# EAGLE design sloth_final (EAGLE 7.6.0)
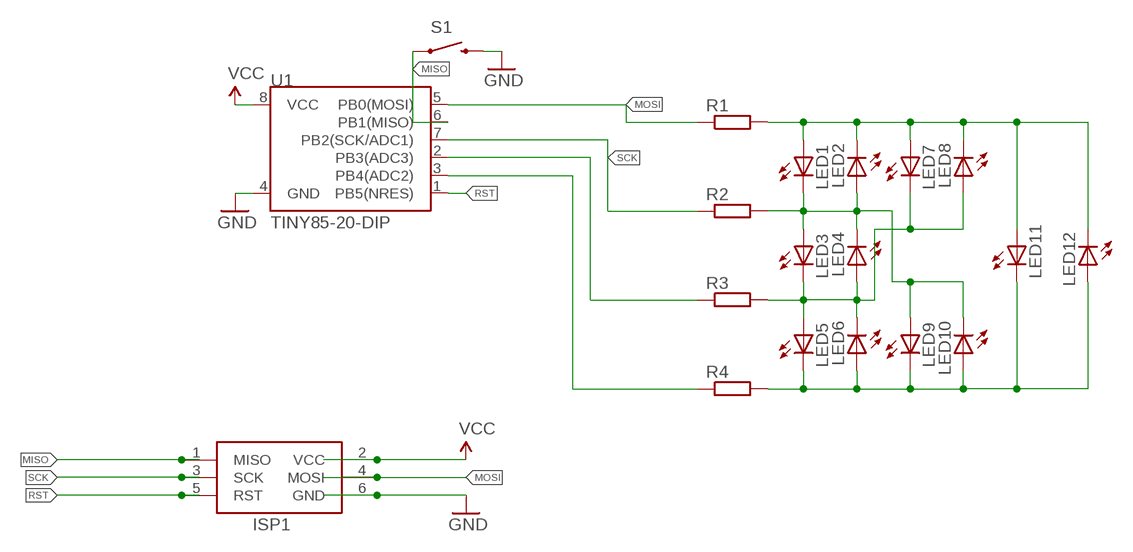
[diagram p0: schematic, sheet 1]

## Parts
ISP1  AVRISP-BOX  [AVRISP-BOX]
LED1  LEDCHIP-LED0805  [CHIP-LED0805]
LED2  LEDCHIP-LED0805  [CHIP-LED0805]
LED3  LEDCHIP-LED0805  [CHIP-LED0805]
LED4  LEDCHIP-LED0805  [CHIP-LED0805]
LED5  LEDCHIP-LED0805  [CHIP-LED0805]
LED6  LEDCHIP-LED0805  [CHIP-LED0805]
LED7  LEDCHIP-LED0805  [CHIP-LED0805]
LED8  LEDCHIP-LED0805  [CHIP-LED0805]
LED9  LEDCHIP-LED0805  [CHIP-LED0805]
LED10  LEDCHIP-LED0805  [CHIP-LED0805]
LED11  LEDCHIP-LED0805  [CHIP-LED0805]
LED12  LEDCHIP-LED0805  [CHIP-LED0805]
R1  R-EU_R0805  [R0805]
R2  R-EU_R0805  [R0805]
R3  R-EU_R0805  [R0805]
R4  R-EU_R0805  [R0805]
S1  SWITCH-MOMENTARY-2PTH  [TACTILE-PTH]
U1  TINY85-20-DIP  ATTINY45TINY85-20-DIP  [DIP08]

## Nets
GND: ISP1.6(GND) S1.3 U1.4(GND)
MISO: ISP1.1(MISO) S1.1 U1.6(PB1(MISO))
MOSI: ISP1.4(MOSI) R1.1 U1.5(PB0(MOSI))
N$1: R4.1 U1.3(PB4(ADC2))
N$2: LED5.C LED6.A LED9.C LED10.A LED11.C LED12.A R4.2
N$9: LED1.A LED2.C LED7.A LED8.C LED11.A LED12.C R1.2
N$11: LED1.C LED2.A LED3.A LED4.C LED9.A LED10.C R2.2
N$12: LED3.C LED4.A LED5.A LED6.C LED7.C LED8.A R3.2
PB3: R3.1 U1.2(PB3(ADC3))
RST: ISP1.5(RST) U1.1(PB5(NRES))
SCK: ISP1.3(SCK) R2.1 U1.7(PB2(SCK/ADC1))
VCC: ISP1.2(VCC) U1.8(VCC)

## Library data of the parts
ISP1 = adafruit:AVRISP: AVR ISP HEADER Standard 6 pin header for AVR programming
LED1-LED12 = led:LED: LED OSRAM: - CHIPLED LG R971, LG N971, LY N971, LG Q971, LY Q971, LO R971, LY R971 LH N974, LH R974 LS Q976, LO Q976, LY Q976 LO Q996 - Hyper CHIPLED LW Q18S LB Q993, LB Q99A, LB R99A - SideLED LS A670, LO A670, LY A670, LG A670, LP A670 LB A673, LV A673, LT A673, LW A673 LH A674 LY A675 LS A676, LA A676, LO A676, LY A676, LW A676 LS A679, LY A679, LG A679 - Hyper Micro SIDELED® LS Y876, LA Y876, LO Y876, LY Y876 LT Y87S - SmartLED LW L88C, LW L88S LB L89C, LB L89S, LG L890 LS L89K, LO L89K, LY L89K LS L896, LA L896, LO L896, LY L896 - TOPLED LS T670, LO T670, LY T670, LG T670, LP T670 LSG T670, LSP T670, LSY T670, LOP T670, LYG T670 LG T671, LOG T671, LSG T671 LB T673, LV T673, LT T673, LW T673 LH T674 LS T676, LA T676, LO T676, LY T676, LB T676, LH T676, LSB T676, LW T676 LB T67C, LV T67C, LT T67C, LS T67K, LO T67K, LY T67K, LW E67C LS E67B, LA E67B, LO E67B, LY E67B, LB E67C, LV E67C, LT E67C LW T67C LS T679, LY T679, LG T679 LS T770, LO T770, LY T770, LG T770, LP T770 LB T773, LV T773, LT T773, LW T773 LH T774 LS E675, LA E675, LY E675, LS T675 LS T776, LA T776, LO T776, LY T776, LB T776 LHGB T686 LT T68C, LB T68C - Hyper Mini TOPLED® LB M676 - Mini TOPLED Santana® LG M470 LS M47K, LO M47K, LY M47K Source: http://www.osram.convergy.de LUXEON: - LUMILED® LXK2-PW12-R00, LXK2-PW12-S00, LXK2-PW14-U00, LXK2-PW14-V00 LXK2-PM12-R00, LXK2-PM12-S00, LXK2-PM14-U00 LXK2-PE12-Q00, LXK2-PE12-R00, LXK2-PE12-S00, LXK2-PE14-T00, LXK2-PE14-U00 LXK2-PB12-K00, LXK2-PB12-L00, LXK2-PB12-M00, LXK2-PB14-N00, LXK2-PB14-P00, LXK2-PB14-Q00 LXK2-PR12-L00, LXK2-PR12-M00, LXK2-PR14-Q00, LXK2-PR14-R00 LXK2-PD12-Q00, LXK2-PD12-R00, LXK2-PD12-S00 LXK2-PH12-R00, LXK2-PH12-S00 LXK2-PL12-P00, LXK2-PL12-Q00, LXK2-PL12-R00 Source: www.luxeon.com KINGBRIGHT: KA-3528ASYC Source: www.kingbright.com
R1-R4 = rcl:R-EU_: RESISTOR, European symbol
S1 = SparkFun-Electromechanical:SWITCH-MOMENTARY-2: Various NO switches- pushbuttons, reed, etc
U1 = SparkFun-DigitalIC:ATTINY45: Atmel 8-pin 2/4/8kB flash uC; PROD_ID: IC-09445

## Board
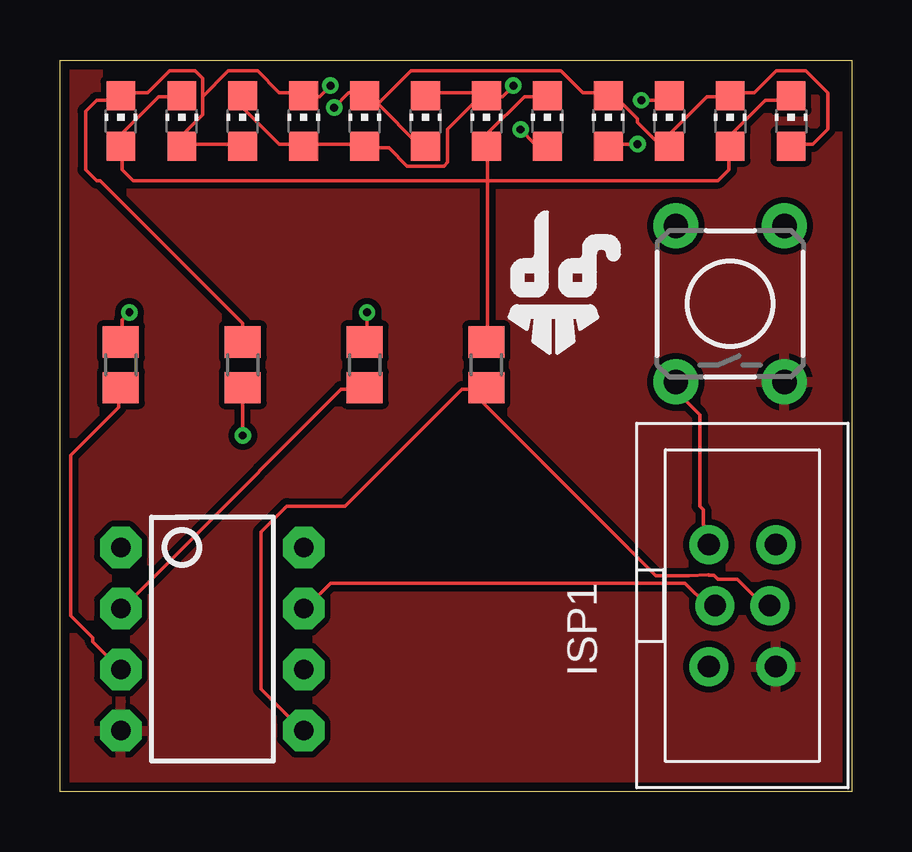
[diagram p1: board, top side]
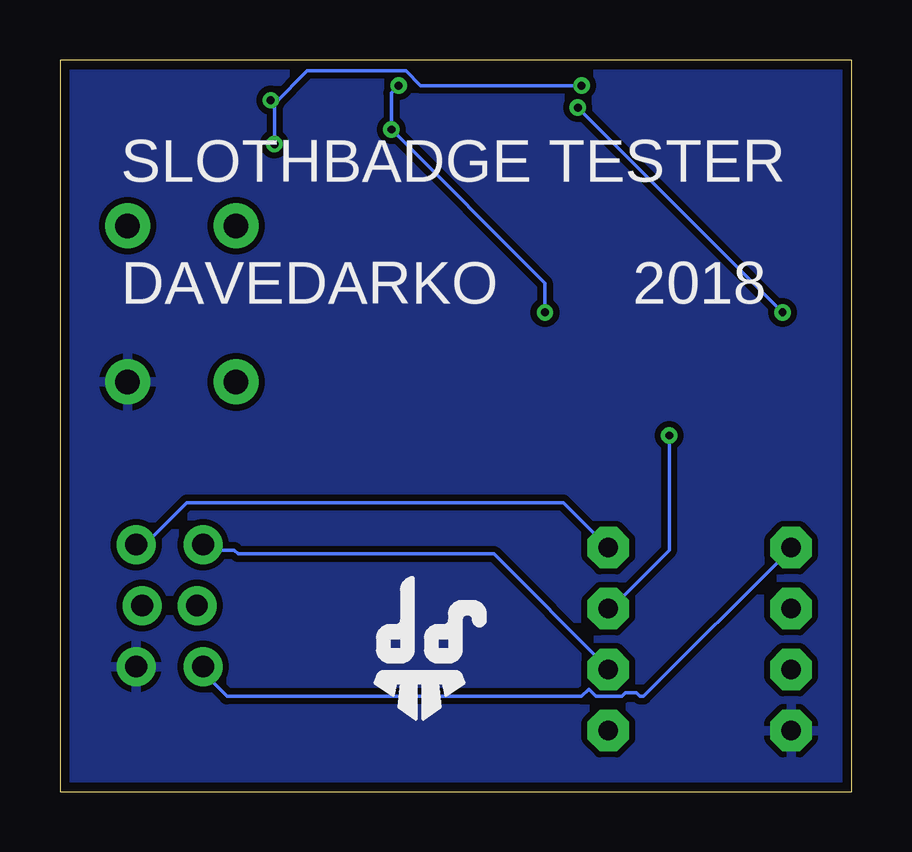
[diagram p2: board, bottom side, seen from below]

Size 33.02 x 30.48 mm. Coordinates in mm from the lower left corner, seen from the top.
Outline: 0,30.48 33.02,30.48 33.02,0 0,0 0,30.48
Copper layers (1*16): Top 0.0356mm / dielectric 1.5011mm / Bottom 0.0356mm
Design rules "LaenPCBOrder *": minimum track width 6mil, minimum drill 13mil, track to track 6mil, track to pad 6mil, pad to pad 6mil, via to via 6mil, smd to smd 6mil, copper to edge 15mil, drill to drill 6mil, minimum pad ring 7mil, minimum via ring 7mil, stop-mask expansion 3mil, vias tented up to drill 200mil, thermal gap 10mil

### Footprints (pad centres in the part's own frame; a part is rotated, then mirrored left to right if it is on the bottom)
AVRISP-BOX = drill 0.9 pad 1.626: 1 -1.397,2.54; 2 1.397,2.54; 3 -1.143,0; 4 1.143,0; 5 -1.397,-2.54; 6 1.397,-2.54
CHIP-LED0805 = smd 1.2 x 1.2: A 0,-1.05; C 0,1.05
R0805 = smd 1.3 x 1.5: 1 -0.95,0; 2 0.95,0
TACTILE-PTH = drill 1.016 pad 1.88: 1 -3.251,2.261; 2 3.251,2.261; 3 -3.251,-2.261; 4 3.251,-2.261
DIP08 = drill 0.813 pad 1.727 octagon: 1 -3.81,-3.81; 2 -1.27,-3.81; 3 1.27,-3.81; 4 3.81,-3.81; 5 3.81,3.81; 6 1.27,3.81; 7 -1.27,3.81; 8 -3.81,3.81

### Placement (x,y rotation side)
ISP1  28.45,7.75 0 top
LED1  2.54,27.94 0 top
LED2  5.08,27.94 0 top
LED3  7.62,27.94 0 top
LED4  10.16,27.94 0 top
LED5  12.7,27.94 0 top
LED6  15.24,27.94 0 top
LED7  17.78,27.94 0 top
LED8  20.32,27.94 0 top
LED9  22.86,27.94 0 top
LED10  25.4,27.94 0 top
LED11  27.94,27.94 0 top
LED12  30.48,27.94 0 top
R1  17.78,17.78 90 top
R2  7.62,17.78 90 top
R3  12.7,17.78 90 top
R4  2.54,17.78 90 top
S1  27.94,20.32 90 top
U1  6.35,6.35 270 top
U$1  [DAVEDARKO2_LOGO]  20.57,20.45 0 top
U$2  [DAVEDARKO2_LOGO]  18.03,5.21 0 bottom

### Tracks (layer width: path | path; a pad name or v marks a point on that pad's centre or on a via)
GND
  pour Bottom (isolate 0.254): -3.54,31 38.46,31 38.46,-1 -3.54,-1
  pour Top (isolate 0.254): -2.54,33.02 35.56,33.02 35.56,-2.54 -2.54,-2.54
MISO
  Top 0.152: ISP1.1 26.98,10.36 26.98,10.97 26.82,11.12 26.82,11.73 26.67,11.89 26.67,15.7 25.76,16.61 25.76,17.07 S1.1
  Bottom 0.152: ISP1.1 26.82,10.06 25.76,10.06 25.6,9.91 14.94,9.91 10.21,5.18 U1.6
MOSI
  Top 0.152: 17.68,16.76 16.76,16.76 11.89,11.89 9.45,11.89 8.38,10.82 8.38,4.27 10.06,2.59 U1.5 | 17.68,16.76 17.68,16.15 24.84,8.99 26.21,8.99 27.03,9.04 27.05,9.02 27.25,9.02 27.43,8.84 28.25,8.84 29.31,7.77 29.57,7.77 ISP1.4 | 17.68,16.76 R1.1
N$1
  Top 0.152: U1.3 1.37,6.25 1.37,6.4 0.46,7.32 0.46,14.02 2.44,16 2.44,16.76 R4.1
N$2  (via drill 0.33)
  Top 0.152: LED12.A 30.48,26.98 31.39,26.98 32,27.58 32,29.11 31.09,30.02 29.87,30.02 28.96,29.11 28.04,29.11 LED11.C 27.89,28.96 26.98,28.96 25.45,27.43 25.45,26.98 LED10.A 25.3,26.98 24.99,26.98 24.08,27.89 24.08,28.04 23.16,28.96 22.86,28.96 LED9.C 22.86,29.11 21.79,29.11 20.88,30.02 14.63,30.02 13.26,28.65 | 13.26,28.65 12.8,29.11 LED5.C | 13.26,28.65 14.94,26.98 15.24,26.98 LED6.A | v2.9,19.96 2.59,19.66 2.59,18.75 R4.2 | v11.43,28.5 12.04,29.11 12.65,29.11 LED5.C | 13.26,28.65 LED5.C
  Bottom 0.152: v11.43,28.5 v2.9,19.96
N$9
  Top 0.152: LED12.C 30.48,28.96 30.33,28.8 29.41,28.8 28.04,27.43 28.04,26.98 LED11.A 27.89,26.82 27.89,25.91 27.43,25.45 17.83,25.45 | LED2.C 5.03,28.96 4.12,28.96 2.59,27.43 2.59,26.98 LED1.A 2.59,26.82 2.59,25.91 3.05,25.45 17.83,25.45 | LED8.C 20.27,28.96 19.36,28.96 17.83,27.43 17.83,26.98 LED7.A 17.83,26.82 17.83,25.45 | 17.83,25.45 17.83,18.75 R1.2
N$11  (via drill 0.33)
  Top 0.152: v24.08,26.98 22.86,26.98 LED9.A | v24.23,28.8 25.15,28.8 25.3,28.96 LED10.C | 5.94,28.96 5.94,28.19 5.18,27.43 5.18,26.98 | 5.94,28.96 5.94,29.72 5.64,30.02 4.57,30.02 3.66,29.11 2.59,29.11 LED1.C 2.44,28.96 2.29,28.8 1.52,28.8 1.07,28.35 1.07,25.91 1.52,25.45 1.68,25.45 7.62,19.51 R2.2 | 5.18,26.98 7.62,26.98 LED3.A | 5.18,26.98 LED2.A | 5.94,28.96 7.01,30.02 8.23,30.02 9.14,29.11 10.06,29.11 LED4.C 10.21,28.96 10.82,28.96 v11.28,29.41
  Bottom 0.152: 24.08,28.65 v24.08,26.98 | 24.08,28.65 22.71,30.02 18.59,30.02 17.98,29.41 v11.28,29.41 | 24.08,28.65 v24.23,28.8
N$12  (via drill 0.33)
  Top 0.152: LED3.C 7.62,28.5 9.14,26.98 10.06,26.98 LED4.A 10.21,26.98 12.65,26.98 LED5.A 12.8,26.82 13.72,26.82 14.48,26.06 16,26.06 16.15,26.21 16.15,27.58 17.68,29.11 | v19.2,27.58 19.81,26.98 20.27,26.98 LED8.A | v18.9,29.41 18.44,28.96 17.83,28.96 LED7.C 17.68,29.11 | 17.68,29.11 15.24,29.11 LED6.C | v12.8,19.96 12.8,18.75 R3.2
  Bottom 0.152: v18.9,29.41 19.2,29.11 v19.2,27.58 12.8,21.18 v12.8,19.96
PB3
  Top 0.152: R3.1 12.65,16.76 11.71,16.76 8.36,13.41 8.23,13.26 2.59,7.62 U1.2
RST
  Bottom 0.152: ISP1.5 26.98,5.18 26.98,4.88 26.06,3.96 11.28,3.96 10.97,4.27 10.67,3.96 9.6,3.96 9.45,4.12 8.99,4.12 8.84,3.96 8.69,3.96 2.59,10.06 U1.1
SCK  (via drill 0.33)
  Top 0.152: v7.62,14.83 R2.1 | ISP1.3 27.28,7.77 26.98,7.77 26.06,8.69 11.28,8.69 10.21,7.62 U1.7
  Bottom 0.152: v7.62,14.83 7.62,10.06 10.06,7.62 U1.7
VCC
  Bottom 0.152: U1.8 12.04,12.04 27.74,12.04 29.41,10.36 29.72,10.36 ISP1.2

### Text on the board
bNames: SLOTHBADGE TESTER | 2018 | DAVEDARKO